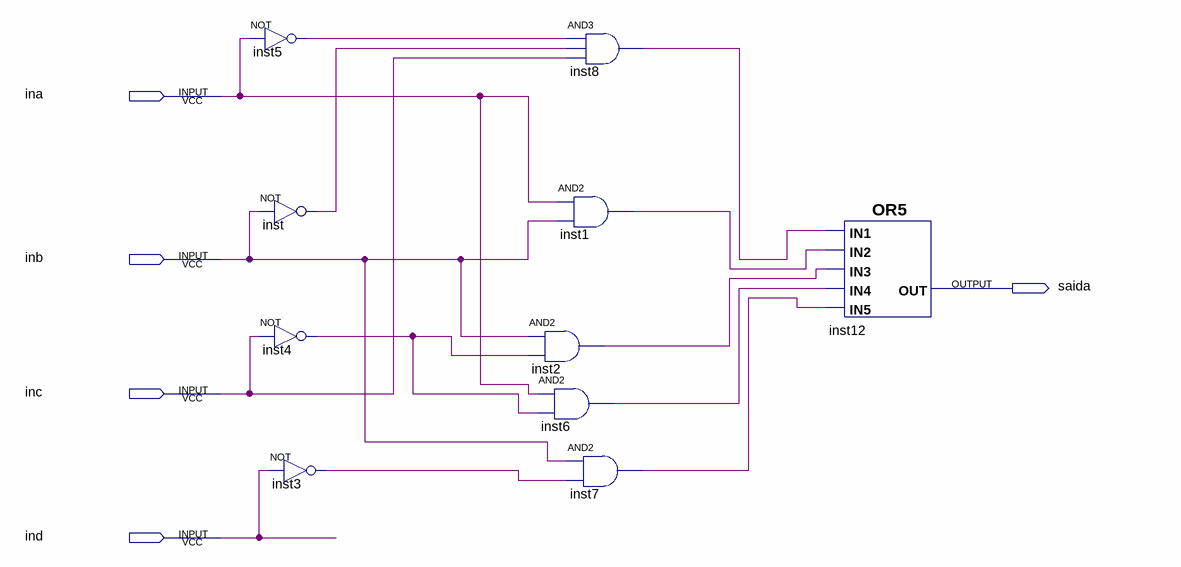
[diagram p0: schematic sheet]
// Quartus schematic g.bdf as structural Verilog: 10 symbols, 5 pins
module g (
  input  ina,
  input  inb,
  input  inc,
  input  ind,
  output saida
);

  wire inst1_out, inst2_out, inst3_out, inst4_out, inst5_out, inst6_out, inst7_out, inst8_out, inst_out;

  not inst5 (inst5_out, ina);
  not inst (inst_out, inb);
  not inst4 (inst4_out, inc);
  not inst3 (inst3_out, ind);
  and inst2 (inst2_out, inb, inst4_out);
  and inst6 (inst6_out, ina, inst4_out);
  and inst8 (inst8_out, inst5_out, inst_out, inc);
  and inst1 (inst1_out, ina, inb);
  and inst7 (inst7_out, inb, inst3_out);
  or inst12 (saida, inst8_out, inst1_out, inst2_out, inst6_out, inst7_out);
endmodule
